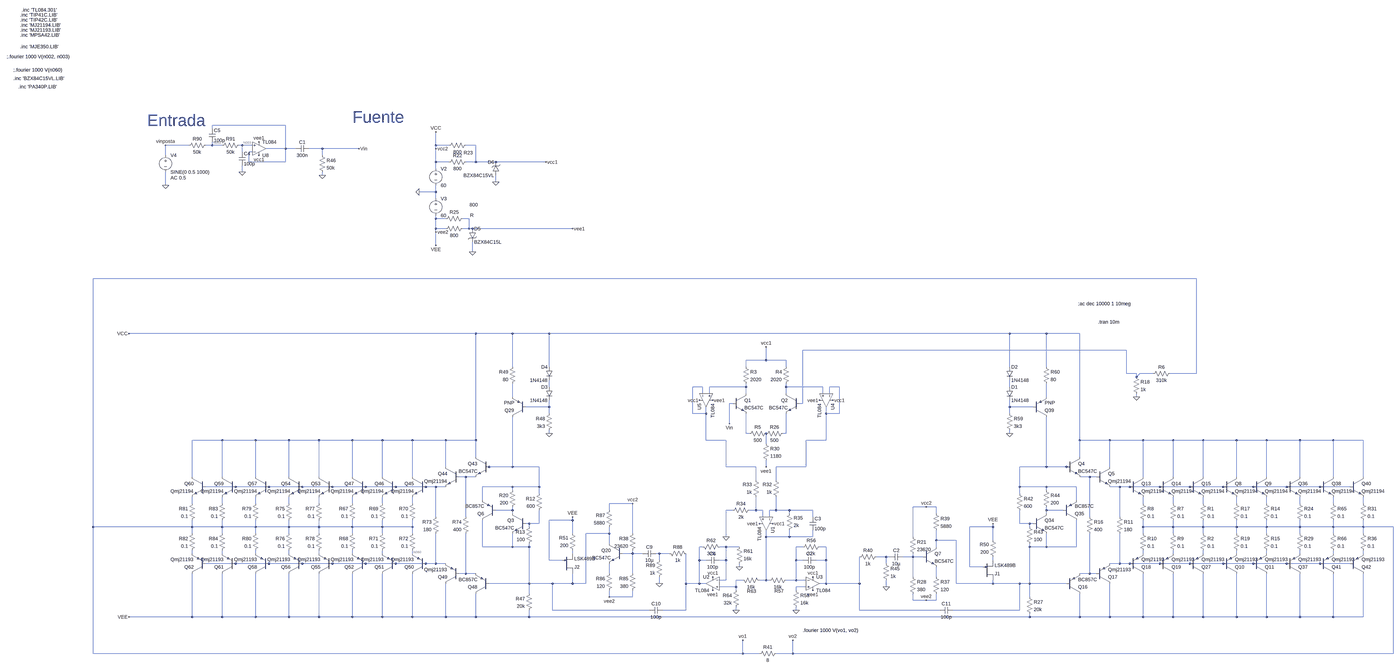
[diagram p0: schematic V7.asc, whole sheet]
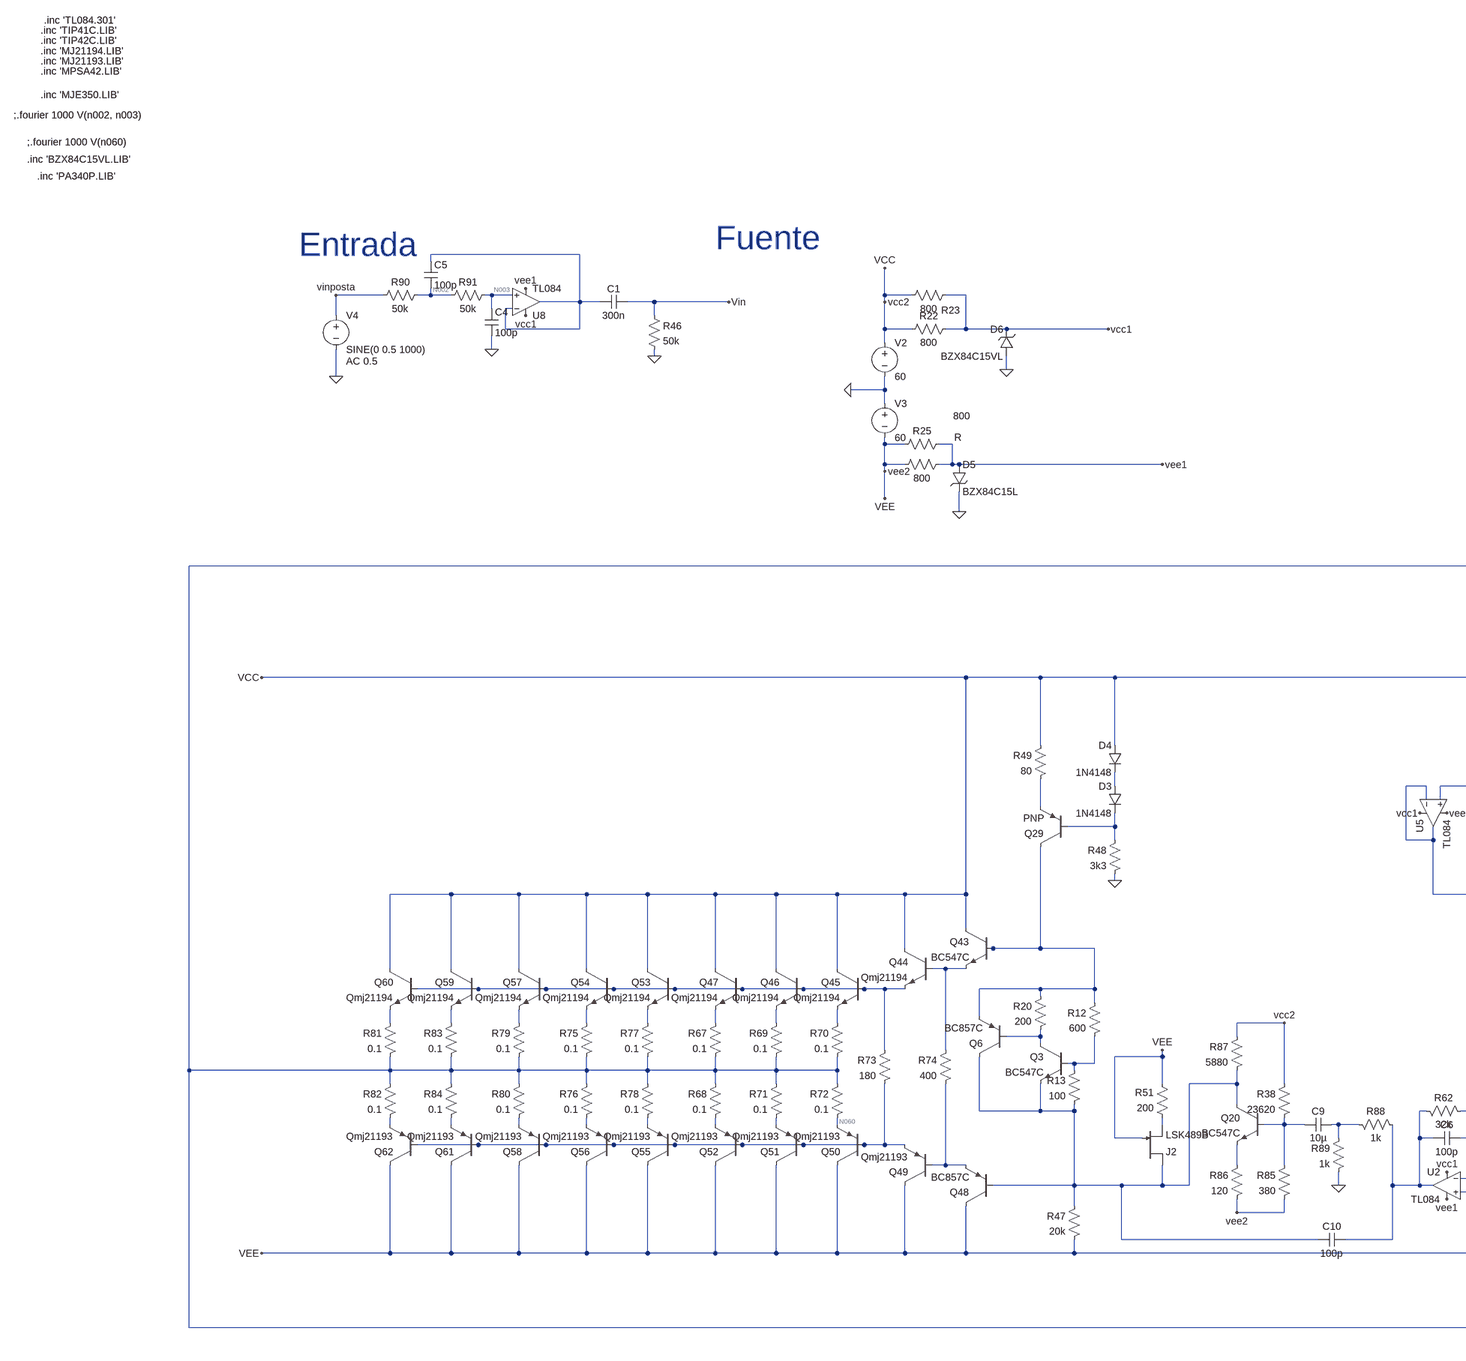
[diagram p1: schematic V7.asc, part, row 1 of 1, column 1 of 2]
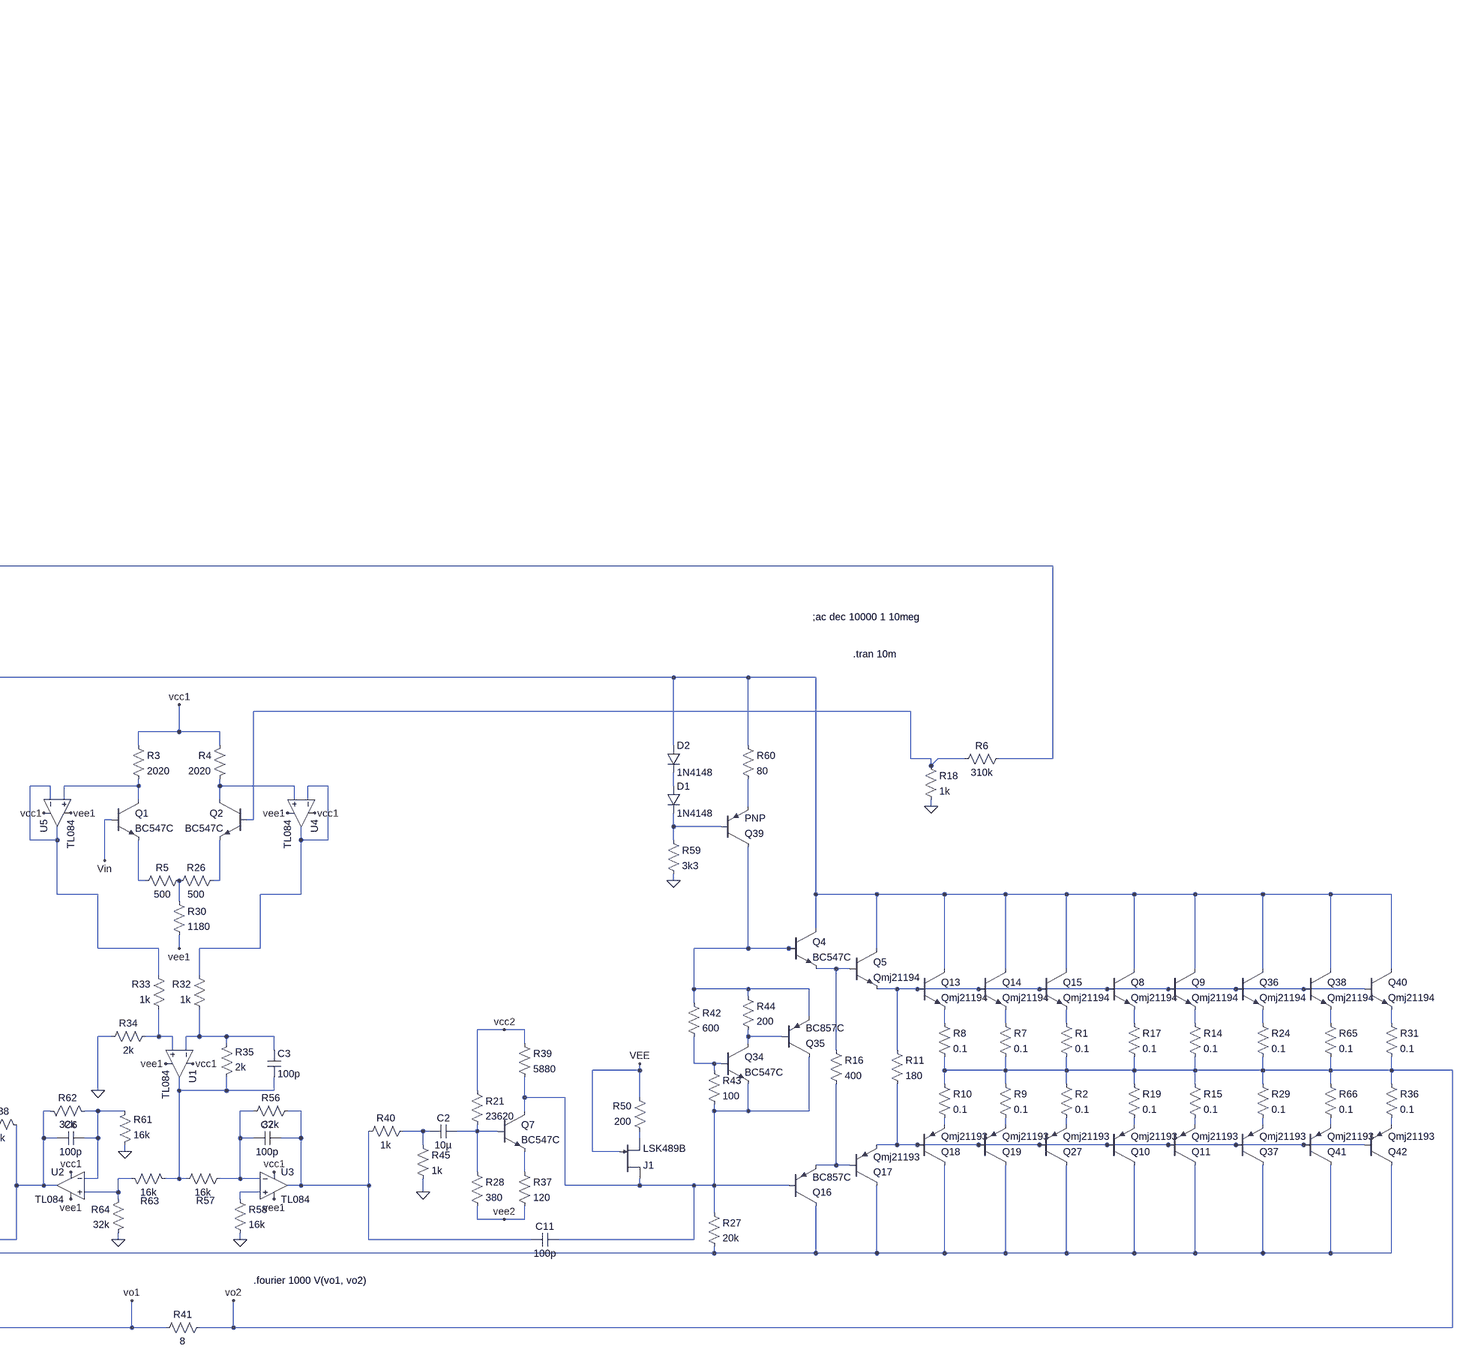
[diagram p2: schematic V7.asc, part, row 1 of 1, column 2 of 2]
V7.asc, the LTspice schematic file:
Version 4
SHEET 1 14776 5396
WIRE 5376 864 5024 864
WIRE 5024 880 5024 864
WIRE 4912 960 4800 960
WIRE 5024 960 5024 944
WIRE 5024 960 4992 960
WIRE 5072 960 5024 960
WIRE 5168 960 5152 960
WIRE 5216 960 5168 960
WIRE 6096 960 6096 896
WIRE 6160 960 6096 960
WIRE 6288 960 6240 960
WIRE 5376 976 5376 864
WIRE 5376 976 5280 976
WIRE 5424 976 5376 976
WIRE 5552 976 5488 976
WIRE 5728 976 5552 976
WIRE 6096 976 6096 960
WIRE 5168 992 5168 960
WIRE 5216 992 5200 992
WIRE 4800 1008 4800 960
WIRE 5552 1008 5552 976
WIRE 5200 1040 5200 992
WIRE 5376 1040 5376 976
WIRE 5376 1040 5200 1040
WIRE 6096 1040 6096 976
WIRE 6160 1040 6096 1040
WIRE 6288 1040 6288 960
WIRE 6288 1040 6240 1040
WIRE 6384 1040 6288 1040
WIRE 6624 1040 6384 1040
WIRE 6096 1072 6096 1040
WIRE 5168 1088 5168 1056
WIRE 5552 1104 5552 1088
WIRE 6384 1136 6384 1104
WIRE 4800 1152 4800 1088
WIRE 6096 1184 6096 1152
WIRE 6096 1184 6016 1184
WIRE 6096 1216 6096 1184
WIRE 6096 1312 6096 1296
WIRE 6144 1312 6096 1312
WIRE 6256 1312 6224 1312
WIRE 6096 1360 6096 1312
WIRE 6144 1360 6096 1360
WIRE 6256 1360 6256 1312
WIRE 6256 1360 6224 1360
WIRE 6272 1360 6256 1360
WIRE 6752 1360 6272 1360
WIRE 6096 1376 6096 1360
WIRE 6096 1440 6096 1376
WIRE 6272 1472 6272 1424
WIRE 9744 1712 4432 1712
WIRE 6288 2000 4624 2000
WIRE 6464 2000 6288 2000
WIRE 6640 2000 6464 2000
WIRE 8848 2000 6640 2000
WIRE 9024 2000 8848 2000
WIRE 9184 2000 9024 2000
WIRE 9408 2080 7856 2080
WIRE 7680 2128 7680 2064
WIRE 7680 2128 7584 2128
WIRE 7776 2128 7680 2128
WIRE 6464 2160 6464 2000
WIRE 6640 2160 6640 2000
WIRE 7584 2160 7584 2128
WIRE 7776 2160 7776 2128
WIRE 8848 2160 8848 2000
WIRE 9024 2160 9024 2000
WIRE 9408 2192 9408 2080
WIRE 9456 2192 9408 2192
WIRE 9536 2192 9472 2192
WIRE 9744 2192 9744 1712
WIRE 9744 2192 9616 2192
WIRE 9456 2208 9456 2192
WIRE 9456 2208 9472 2192
WIRE 6640 2256 6640 2224
WIRE 7376 2256 7328 2256
WIRE 7584 2256 7584 2240
WIRE 7584 2256 7408 2256
WIRE 7776 2256 7776 2240
WIRE 7952 2256 7776 2256
WIRE 8032 2256 7984 2256
WIRE 8848 2256 8848 2224
WIRE 7376 2288 7376 2256
WIRE 7408 2288 7408 2256
WIRE 7584 2288 7584 2256
WIRE 7776 2288 7776 2256
WIRE 7952 2288 7952 2256
WIRE 7984 2288 7984 2256
WIRE 6464 2304 6464 2240
WIRE 9024 2304 9024 2240
WIRE 9456 2304 9456 2288
WIRE 7520 2336 7504 2336
WIRE 7856 2336 7856 2080
WIRE 7856 2336 7840 2336
WIRE 6640 2352 6640 2320
WIRE 6640 2352 6528 2352
WIRE 8848 2352 8848 2320
WIRE 8960 2352 8848 2352
WIRE 6640 2384 6640 2352
WIRE 7328 2384 7328 2256
WIRE 7392 2384 7392 2352
WIRE 7392 2384 7328 2384
WIRE 7968 2384 7968 2352
WIRE 8032 2384 8032 2256
WIRE 8032 2384 7968 2384
WIRE 8848 2384 8848 2352
WIRE 7504 2432 7504 2336
WIRE 6640 2480 6640 2464
WIRE 7584 2480 7584 2384
WIRE 7600 2480 7584 2480
WIRE 7776 2480 7776 2384
WIRE 7776 2480 7760 2480
WIRE 8848 2480 8848 2464
WIRE 5072 2512 4928 2512
WIRE 5232 2512 5072 2512
WIRE 5392 2512 5232 2512
WIRE 5536 2512 5392 2512
WIRE 5696 2512 5536 2512
WIRE 5840 2512 5696 2512
WIRE 5984 2512 5840 2512
WIRE 6144 2512 5984 2512
WIRE 6288 2512 6288 2000
WIRE 6288 2512 6144 2512
WIRE 7392 2512 7392 2384
WIRE 7488 2512 7392 2512
WIRE 7968 2512 7968 2384
WIRE 7968 2512 7872 2512
WIRE 9184 2512 9184 2000
WIRE 9328 2512 9184 2512
WIRE 9488 2512 9328 2512
WIRE 9632 2512 9488 2512
WIRE 9776 2512 9632 2512
WIRE 9936 2512 9776 2512
WIRE 10080 2512 9936 2512
WIRE 10240 2512 10080 2512
WIRE 10400 2512 10240 2512
WIRE 10544 2512 10400 2512
WIRE 7680 2528 7680 2480
WIRE 6288 2592 6288 2512
WIRE 9184 2592 9184 2512
WIRE 6144 2640 6144 2512
WIRE 6352 2640 6336 2640
WIRE 6464 2640 6464 2400
WIRE 6464 2640 6352 2640
WIRE 6592 2640 6464 2640
WIRE 7488 2640 7488 2512
WIRE 7632 2640 7488 2640
WIRE 7680 2640 7680 2608
WIRE 7872 2640 7872 2512
WIRE 7872 2640 7728 2640
WIRE 9024 2640 9024 2400
WIRE 9024 2640 8896 2640
WIRE 9120 2640 9024 2640
WIRE 9136 2640 9120 2640
WIRE 9328 2640 9328 2512
WIRE 4928 2688 4928 2512
WIRE 5072 2688 5072 2512
WIRE 5232 2688 5232 2512
WIRE 5392 2688 5392 2512
WIRE 5536 2688 5536 2512
WIRE 5696 2688 5696 2512
WIRE 5840 2688 5840 2512
WIRE 5984 2688 5984 2512
WIRE 6240 2688 6208 2688
WIRE 6288 2688 6240 2688
WIRE 9232 2688 9184 2688
WIRE 9264 2688 9232 2688
WIRE 9488 2688 9488 2512
WIRE 9632 2688 9632 2512
WIRE 9776 2688 9776 2512
WIRE 9936 2688 9936 2512
WIRE 10080 2688 10080 2512
WIRE 10240 2688 10240 2512
WIRE 10400 2688 10400 2512
WIRE 10544 2688 10544 2512
WIRE 7632 2704 7632 2640
WIRE 7728 2704 7728 2640
WIRE 5136 2736 4992 2736
WIRE 5296 2736 5136 2736
WIRE 5456 2736 5296 2736
WIRE 5600 2736 5456 2736
WIRE 5760 2736 5600 2736
WIRE 5904 2736 5760 2736
WIRE 6048 2736 5904 2736
WIRE 6096 2736 6048 2736
WIRE 6144 2736 6096 2736
WIRE 6464 2736 6320 2736
WIRE 6592 2736 6592 2640
WIRE 6592 2736 6464 2736
WIRE 8896 2736 8896 2640
WIRE 9024 2736 8896 2736
WIRE 9168 2736 9024 2736
WIRE 9376 2736 9328 2736
WIRE 9424 2736 9376 2736
WIRE 9568 2736 9424 2736
WIRE 9712 2736 9568 2736
WIRE 9872 2736 9712 2736
WIRE 10016 2736 9872 2736
WIRE 10176 2736 10016 2736
WIRE 10336 2736 10176 2736
WIRE 10480 2736 10336 2736
WIRE 6464 2752 6464 2736
WIRE 9024 2752 9024 2736
WIRE 6592 2768 6592 2736
WIRE 8896 2768 8896 2736
WIRE 6320 2800 6320 2736
WIRE 9168 2800 9168 2736
WIRE 4928 2816 4928 2784
WIRE 5072 2816 5072 2784
WIRE 5232 2816 5232 2784
WIRE 5392 2816 5392 2784
WIRE 5536 2816 5536 2784
WIRE 5696 2816 5696 2784
WIRE 5840 2816 5840 2784
WIRE 5984 2816 5984 2784
WIRE 7040 2816 6928 2816
WIRE 9488 2816 9488 2784
WIRE 9632 2816 9632 2784
WIRE 9776 2816 9776 2784
WIRE 9936 2816 9936 2784
WIRE 10080 2816 10080 2784
WIRE 10240 2816 10240 2784
WIRE 10400 2816 10400 2784
WIRE 10544 2816 10544 2784
WIRE 8448 2832 8384 2832
WIRE 8496 2832 8448 2832
WIRE 6464 2848 6464 2832
WIRE 6464 2848 6384 2848
WIRE 6928 2848 6928 2816
WIRE 7520 2848 7488 2848
WIRE 7632 2848 7632 2784
WIRE 7632 2848 7600 2848
WIRE 7664 2848 7632 2848
WIRE 7728 2848 7728 2784
WIRE 7728 2848 7696 2848
WIRE 7792 2848 7728 2848
WIRE 7904 2848 7792 2848
WIRE 9024 2848 9024 2832
WIRE 9104 2848 9024 2848
WIRE 6464 2864 6464 2848
WIRE 7792 2864 7792 2848
WIRE 8496 2864 8496 2832
WIRE 9024 2864 9024 2848
WIRE 6096 2880 6096 2736
WIRE 6240 2880 6240 2688
WIRE 7664 2880 7664 2848
WIRE 7696 2880 7696 2848
WIRE 7904 2880 7904 2848
WIRE 9232 2880 9232 2688
WIRE 9376 2880 9376 2736
WIRE 6752 2896 6752 2880
WIRE 6752 2896 6640 2896
WIRE 6544 2912 6528 2912
WIRE 6592 2912 6592 2848
WIRE 6592 2912 6544 2912
WIRE 8896 2912 8896 2848
WIRE 8944 2912 8896 2912
WIRE 8960 2912 8944 2912
WIRE 4432 2928 4432 1712
WIRE 4928 2928 4928 2896
WIRE 4928 2928 4432 2928
WIRE 5072 2928 5072 2896
WIRE 5072 2928 4928 2928
WIRE 5232 2928 5232 2896
WIRE 5232 2928 5072 2928
WIRE 5392 2928 5392 2896
WIRE 5392 2928 5232 2928
WIRE 5536 2928 5536 2896
WIRE 5536 2928 5392 2928
WIRE 5696 2928 5696 2896
WIRE 5696 2928 5536 2928
WIRE 5840 2928 5840 2896
WIRE 5840 2928 5696 2928
WIRE 5984 2928 5984 2896
WIRE 5984 2928 5840 2928
WIRE 6544 2928 6544 2912
WIRE 8768 2928 8768 2912
WIRE 8768 2928 8656 2928
WIRE 8944 2928 8944 2912
WIRE 9488 2928 9488 2896
WIRE 9632 2928 9632 2896
WIRE 9632 2928 9488 2928
WIRE 9776 2928 9776 2896
WIRE 9776 2928 9632 2928
WIRE 9936 2928 9936 2896
WIRE 9936 2928 9776 2928
WIRE 10080 2928 10080 2896
WIRE 10080 2928 9936 2928
WIRE 10240 2928 10240 2896
WIRE 10240 2928 10080 2928
WIRE 10400 2928 10400 2896
WIRE 10400 2928 10240 2928
WIRE 10544 2928 10544 2896
WIRE 10544 2928 10400 2928
WIRE 10688 2928 10544 2928
WIRE 4928 2960 4928 2928
WIRE 5072 2960 5072 2928
WIRE 5232 2960 5232 2928
WIRE 5392 2960 5392 2928
WIRE 5536 2960 5536 2928
WIRE 5696 2960 5696 2928
WIRE 5840 2960 5840 2928
WIRE 5984 2960 5984 2928
WIRE 6752 2960 6752 2896
WIRE 6928 2960 6928 2928
WIRE 6928 2960 6816 2960
WIRE 7040 2960 7040 2816
WIRE 9488 2960 9488 2928
WIRE 9632 2960 9632 2928
WIRE 9776 2960 9776 2928
WIRE 9936 2960 9936 2928
WIRE 10080 2960 10080 2928
WIRE 10240 2960 10240 2928
WIRE 10400 2960 10400 2928
WIRE 10544 2960 10544 2928
WIRE 7488 2976 7488 2848
WIRE 7680 2976 7680 2944
WIRE 7792 2976 7792 2944
WIRE 7792 2976 7680 2976
WIRE 7904 2976 7904 2944
WIRE 7904 2976 7792 2976
WIRE 8384 2976 8384 2832
WIRE 8496 2992 8496 2944
WIRE 8592 2992 8496 2992
WIRE 8768 2992 8768 2928
WIRE 6928 3008 6928 2960
WIRE 6320 3024 6320 2896
WIRE 6464 3024 6464 2960
WIRE 6464 3024 6320 3024
WIRE 6544 3024 6544 3008
WIRE 6544 3024 6464 3024
WIRE 7376 3024 7360 3024
WIRE 7488 3024 7456 3024
WIRE 7552 3024 7488 3024
WIRE 7856 3024 7824 3024
WIRE 7968 3024 7936 3024
WIRE 8496 3024 8496 2992
WIRE 8944 3024 8944 3008
WIRE 9024 3024 9024 2960
WIRE 9024 3024 8944 3024
WIRE 9168 3024 9168 2896
WIRE 9168 3024 9024 3024
WIRE 4928 3056 4928 3040
WIRE 5072 3056 5072 3040
WIRE 5232 3056 5232 3040
WIRE 5392 3056 5392 3040
WIRE 5536 3056 5536 3040
WIRE 5696 3056 5696 3040
WIRE 5840 3056 5840 3040
WIRE 5984 3056 5984 3040
WIRE 6752 3056 6752 3040
WIRE 7040 3056 7040 3040
WIRE 7040 3056 6992 3056
WIRE 7088 3056 7040 3056
WIRE 7168 3056 7152 3056
WIRE 7216 3056 7168 3056
WIRE 9488 3056 9488 3040
WIRE 9632 3056 9632 3040
WIRE 9776 3056 9776 3040
WIRE 9936 3056 9936 3040
WIRE 10080 3056 10080 3040
WIRE 10240 3056 10240 3040
WIRE 10400 3056 10400 3040
WIRE 10544 3056 10544 3040
WIRE 8256 3072 8208 3072
WIRE 8272 3072 8256 3072
WIRE 8384 3072 8384 3056
WIRE 8384 3072 8336 3072
WIRE 8432 3072 8384 3072
WIRE 6640 3088 6640 2896
WIRE 6704 3088 6640 3088
WIRE 7168 3088 7168 3056
WIRE 7360 3088 7360 3024
WIRE 7392 3088 7360 3088
WIRE 7488 3088 7488 3024
WIRE 7488 3088 7456 3088
WIRE 7824 3088 7824 3024
WIRE 7856 3088 7824 3088
WIRE 7968 3088 7968 3024
WIRE 7968 3088 7920 3088
WIRE 8768 3088 8768 3072
WIRE 5136 3104 4992 3104
WIRE 5296 3104 5136 3104
WIRE 5456 3104 5296 3104
WIRE 5600 3104 5456 3104
WIRE 5760 3104 5600 3104
WIRE 5904 3104 5760 3104
WIRE 6048 3104 5904 3104
WIRE 6096 3104 6096 2960
WIRE 6096 3104 6048 3104
WIRE 6144 3104 6096 3104
WIRE 8256 3104 8256 3072
WIRE 9376 3104 9376 2960
WIRE 9376 3104 9328 3104
WIRE 9424 3104 9376 3104
WIRE 9568 3104 9424 3104
WIRE 9712 3104 9568 3104
WIRE 9872 3104 9712 3104
WIRE 10016 3104 9872 3104
WIRE 10176 3104 10016 3104
WIRE 10336 3104 10176 3104
WIRE 10480 3104 10336 3104
WIRE 7552 3120 7552 3104
WIRE 8656 3120 8656 2928
WIRE 8720 3120 8656 3120
WIRE 6240 3152 6240 2960
WIRE 6240 3152 6208 3152
WIRE 6288 3152 6240 3152
WIRE 6928 3152 6928 3104
WIRE 7040 3152 7040 3056
WIRE 9232 3152 9232 2960
WIRE 9232 3152 9184 3152
WIRE 9264 3152 9232 3152
WIRE 8384 3168 8384 3072
WIRE 8496 3168 8496 3120
WIRE 7488 3184 7488 3088
WIRE 7488 3184 7456 3184
WIRE 7568 3184 7536 3184
WIRE 7680 3184 7680 2976
WIRE 7680 3184 7648 3184
WIRE 7696 3184 7680 3184
WIRE 7824 3184 7824 3088
WIRE 7824 3184 7776 3184
WIRE 7872 3184 7824 3184
WIRE 6544 3200 6544 3024
WIRE 6544 3200 6352 3200
WIRE 6656 3200 6544 3200
WIRE 6752 3200 6752 3152
WIRE 6752 3200 6656 3200
WIRE 6816 3200 6816 2960
WIRE 6816 3200 6752 3200
WIRE 7168 3200 7168 3168
WIRE 7296 3200 7296 3056
WIRE 7360 3200 7360 3088
WIRE 7360 3200 7296 3200
WIRE 7392 3200 7360 3200
WIRE 7968 3200 7968 3088
WIRE 7968 3200 7936 3200
WIRE 8128 3200 8128 3072
WIRE 8128 3200 7968 3200
WIRE 8592 3200 8592 2992
WIRE 8768 3200 8768 3184
WIRE 8768 3200 8592 3200
WIRE 8896 3200 8768 3200
WIRE 8944 3200 8944 3024
WIRE 8944 3200 8896 3200
WIRE 9120 3200 8944 3200
WIRE 7536 3216 7536 3184
WIRE 7536 3216 7456 3216
WIRE 7872 3216 7824 3216
WIRE 8256 3216 8256 3184
WIRE 7536 3232 7536 3216
WIRE 7824 3232 7824 3216
WIRE 6544 3248 6544 3200
WIRE 6928 3264 6928 3232
WIRE 7040 3264 7040 3232
WIRE 7040 3264 6928 3264
WIRE 8944 3264 8944 3200
WIRE 8384 3280 8384 3248
WIRE 8448 3280 8384 3280
WIRE 8496 3280 8496 3248
WIRE 8496 3280 8448 3280
WIRE 6656 3328 6656 3200
WIRE 7120 3328 6656 3328
WIRE 7296 3328 7296 3200
WIRE 7296 3328 7184 3328
WIRE 7536 3328 7536 3312
WIRE 7824 3328 7824 3312
WIRE 8128 3328 8128 3200
WIRE 8512 3328 8128 3328
WIRE 8896 3328 8896 3200
WIRE 8896 3328 8576 3328
WIRE 4928 3360 4928 3152
WIRE 4928 3360 4624 3360
WIRE 5072 3360 5072 3152
WIRE 5072 3360 4928 3360
WIRE 5232 3360 5232 3152
WIRE 5232 3360 5072 3360
WIRE 5392 3360 5392 3152
WIRE 5392 3360 5232 3360
WIRE 5536 3360 5536 3152
WIRE 5536 3360 5392 3360
WIRE 5696 3360 5696 3152
WIRE 5696 3360 5536 3360
WIRE 5840 3360 5840 3152
WIRE 5840 3360 5696 3360
WIRE 5984 3360 5984 3152
WIRE 5984 3360 5840 3360
WIRE 6144 3360 6144 3200
WIRE 6144 3360 5984 3360
WIRE 6288 3360 6288 3248
WIRE 6288 3360 6144 3360
WIRE 6544 3360 6544 3328
WIRE 6544 3360 6288 3360
WIRE 8944 3360 8944 3344
WIRE 8944 3360 6544 3360
WIRE 9184 3360 9184 3248
WIRE 9184 3360 8944 3360
WIRE 9328 3360 9328 3200
WIRE 9328 3360 9184 3360
WIRE 9488 3360 9488 3152
WIRE 9488 3360 9328 3360
WIRE 9632 3360 9632 3152
WIRE 9632 3360 9488 3360
WIRE 9776 3360 9776 3152
WIRE 9776 3360 9632 3360
WIRE 9936 3360 9936 3152
WIRE 9936 3360 9776 3360
WIRE 10080 3360 10080 3152
WIRE 10080 3360 9936 3360
WIRE 10240 3360 10240 3152
WIRE 10240 3360 10080 3360
WIRE 10400 3360 10400 3152
WIRE 10400 3360 10240 3360
WIRE 10544 3360 10544 3152
WIRE 10544 3360 10400 3360
WIRE 4432 3536 4432 2928
WIRE 7568 3536 7568 3472
WIRE 7568 3536 4432 3536
WIRE 7648 3536 7568 3536
WIRE 7808 3536 7808 3472
WIRE 7808 3536 7728 3536
WIRE 10688 3536 10688 2928
WIRE 10688 3536 7808 3536
FLAG 6016 1184 0
FLAG 4800 1152 0
FLAG 5728 976 Vin
FLAG 6096 896 VCC
FLAG 6096 1440 VEE
FLAG 7680 2640 vee1
FLAG 7648 2912 vee1
FLAG 7680 2064 vcc1
FLAG 7712 2912 vcc1
FLAG 6096 976 vcc2
FLAG 6096 1376 vee2
FLAG 8848 2480 0
FLAG 6640 2480 0
FLAG 4624 3360 VEE
FLAG 4624 2000 VCC
FLAG 7488 2976 0
FLAG 7824 3328 0
FLAG 7552 3120 0
FLAG 7536 3328 0
FLAG 6384 1136 0
FLAG 6272 1472 0
FLAG 7568 3472 vo1
FLAG 7808 3472 vo2
FLAG 8000 2320 vcc1
FLAG 7936 2320 vee1
FLAG 7360 2320 vcc1
FLAG 7424 2320 vee1
FLAG 7904 3232 vee1
FLAG 7424 3232 vee1
FLAG 7424 3168 vcc1
FLAG 7904 3168 vcc1
FLAG 6624 1040 vcc1
FLAG 6752 1360 vee1
FLAG 7504 2432 Vin
FLAG 8448 2832 vcc2
FLAG 8448 3280 vee2
FLAG 8256 3216 0
FLAG 7040 2816 vcc2
FLAG 6928 3264 vee2
FLAG 7168 3200 0
FLAG 9456 2304 0
FLAG 5168 1088 0
FLAG 5248 1008 vcc1
FLAG 5248 944 vee1
FLAG 4800 960 vinposta
FLAG 5552 1104 0
FLAG 8768 2912 VEE
FLAG 6752 2880 VEE
SYMBOL npn 9120 2592 R0
SYMATTR InstName Q4
SYMATTR Value BC547C
SYMBOL npn 9264 2640 R0
SYMATTR InstName Q5
SYMATTR Value Qmj21194
SYMBOL npn 9424 2688 R0
SYMATTR InstName Q13
SYMATTR Value Qmj21194
SYMBOL npn 9568 2688 R0
SYMATTR InstName Q14
SYMATTR Value Qmj21194
SYMBOL npn 9712 2688 R0
SYMATTR InstName Q15
SYMATTR Value Qmj21194
SYMBOL pnp 9120 3248 M180
SYMATTR InstName Q16
SYMATTR Value BC857C
SYMBOL pnp 9264 3200 M180
SYMATTR InstName Q17
SYMATTR Value Qmj21193
SYMBOL pnp 9424 3152 M180
SYMATTR InstName Q18
SYMATTR Value Qmj21193
SYMBOL pnp 9568 3152 M180
SYMATTR InstName Q19
SYMATTR Value Qmj21193
SYMBOL pnp 9712 3152 M180
SYMATTR InstName Q27
SYMATTR Value Qmj21193
SYMBOL res 9760 2800 R0
SYMATTR InstName R1
SYMATTR Value 0.1
SYMBOL res 9760 2944 R0
SYMATTR InstName R2
SYMATTR Value 0.1
SYMBOL res 9616 2800 R0
SYMATTR InstName R7
SYMATTR Value 0.1
SYMBOL res 9472 2800 R0
SYMATTR InstName R8
SYMATTR Value 0.1
SYMBOL res 9616 2944 R0
SYMATTR InstName R9
SYMATTR Value 0.1
SYMBOL res 9472 2944 R0
SYMATTR InstName R10
SYMATTR Value 0.1
SYMBOL res 9360 2864 R0
SYMATTR InstName R11
SYMATTR Value 180
SYMBOL res 9216 2864 R0
SYMATTR InstName R16
SYMATTR Value 400
SYMBOL npn 8960 2864 R0
SYMATTR InstName Q34
SYMATTR Value BC547C
SYMBOL res 8880 2752 R0
SYMATTR InstName R42
SYMATTR Value 600
SYMBOL res 8928 2912 R0
SYMATTR InstName R43
SYMATTR Value 100
SYMBOL res 9008 2736 R0
SYMATTR InstName R44
SYMATTR Value 200
SYMBOL pnp 9104 2896 M180
SYMATTR InstName Q35
SYMATTR Value BC857C
SYMBOL voltage 6096 1056 R0
WINDOW 123 0 0 Left 0
WINDOW 39 24 44 Left 2
SYMATTR InstName V2
SYMATTR Value 60
SYMBOL voltage 6096 1200 R0
WINDOW 123 0 0 Left 0
WINDOW 39 24 124 Left 2
SYMATTR InstName V3
SYMATTR Value 60
SYMBOL voltage 4800 992 R0
WINDOW 123 24 124 Left 2
WINDOW 39 0 0 Left 0
SYMATTR Value2 AC 0.5
SYMATTR InstName V4
SYMATTR Value SINE(0 0.5 1000)
SYMBOL npn 7520 2288 R0
SYMATTR InstName Q1
SYMATTR Value BC547C
SYMBOL npn 7840 2288 M0
SYMATTR InstName Q2
SYMATTR Value BC547C
SYMBOL res 7568 2144 R0
SYMATTR InstName R3
SYMATTR Value 2020
SYMBOL res 7792 2144 M0
SYMATTR InstName R4
SYMATTR Value 2020
SYMBOL res 7696 2464 R90
WINDOW 0 0 56 VBottom 2
WINDOW 3 32 56 VTop 2
SYMATTR InstName R5
SYMATTR Value 500
SYMBOL res 7776 2464 R90
WINDOW 0 0 56 VBottom 2
WINDOW 3 32 56 VTop 2
SYMATTR InstName R26
SYMATTR Value 500
SYMBOL res 7664 2512 R0
SYMATTR InstName R30
SYMATTR Value 1180
SYMBOL Opamps\\opamp2 7744 2912 R90
SYMATTR InstName U1
SYMATTR Value TL084
SYMBOL res 7744 2800 R180
WINDOW 0 36 76 Left 2
WINDOW 3 36 40 Left 2
SYMATTR InstName R32
SYMATTR Value 1k
SYMBOL res 7648 2800 R180
WINDOW 0 36 76 Left 2
WINDOW 3 36 40 Left 2
SYMATTR InstName R33
SYMATTR Value 1k
SYMBOL res 7616 2832 R90
WINDOW 0 0 56 VBottom 2
WINDOW 3 32 56 VTop 2
SYMATTR InstName R34
SYMATTR Value 2k
SYMBOL res 7776 2960 M180
WINDOW 0 36 76 Left 2
WINDOW 3 36 40 Left 2
SYMATTR InstName R35
SYMATTR Value 2k
SYMBOL res 8928 3248 R0
SYMATTR InstName R27
SYMATTR Value 20k
SYMBOL pnp 8960 2400 M180
SYMATTR InstName Q39
SYMBOL res 8832 2368 R0
SYMATTR InstName R59
SYMATTR Value 3k3
SYMBOL diode 8832 2256 R0
SYMATTR InstName D1
SYMATTR Value 1N4148
SYMBOL diode 8832 2160 R0
SYMATTR InstName D2
SYMATTR Value 1N4148
SYMBOL res 9008 2144 R0
SYMATTR InstName R60
SYMATTR Value 80
SYMBOL npn 9872 2688 R0
SYMATTR InstName Q8
SYMATTR Value Qmj21194
SYMBOL npn 10016 2688 R0
SYMATTR InstName Q9
SYMATTR Value Qmj21194
SYMBOL pnp 9872 3152 M180
SYMATTR InstName Q10
SYMATTR Value Qmj21193
SYMBOL pnp 10016 3152 M180
SYMATTR InstName Q11
SYMATTR Value Qmj21193
SYMBOL res 10064 2800 R0
SYMATTR InstName R14
SYMATTR Value 0.1
SYMBOL res 10064 2944 R0
SYMATTR InstName R15
SYMATTR Value 0.1
SYMBOL res 9920 2800 R0
SYMATTR InstName R17
SYMATTR Value 0.1
SYMBOL res 9920 2944 R0
SYMATTR InstName R19
SYMATTR Value 0.1
SYMBOL res 6560 3232 M0
SYMATTR InstName R47
SYMATTR Value 20k
SYMBOL pnp 6528 2400 R180
SYMATTR InstName Q29
SYMBOL res 6656 2368 M0
SYMATTR InstName R48
SYMATTR Value 3k3
SYMBOL diode 6656 2256 M0
SYMATTR InstName D3
SYMATTR Value 1N4148
SYMBOL diode 6656 2160 M0
SYMATTR InstName D4
SYMATTR Value 1N4148
SYMBOL res 6480 2144 M0
SYMATTR InstName R49
SYMATTR Value 80
SYMBOL res 7744 3520 R90
WINDOW 0 0 56 VBottom 2
WINDOW 3 32 56 VTop 2
SYMATTR InstName R41
SYMATTR Value 8
SYMBOL res 7952 3008 R90
WINDOW 0 0 56 VBottom 2
WINDOW 3 32 56 VTop 2
SYMATTR InstName R56
SYMATTR Value 32k
SYMBOL res 7792 3168 R90
WINDOW 0 83 50 VBottom 2
WINDOW 3 32 56 VTop 2
SYMATTR InstName R57
SYMATTR Value 16k
SYMBOL res 7808 3216 R0
SYMATTR InstName R58
SYMATTR Value 16k
SYMBOL res 7536 3120 M180
WINDOW 0 36 76 Left 2
WINDOW 3 36 40 Left 2
SYMATTR InstName R61
SYMATTR Value 16k
SYMBOL res 7360 3008 M90
WINDOW 0 0 56 VBottom 2
WINDOW 3 32 56 VTop 2
SYMATTR InstName R62
SYMATTR Value 32k
SYMBOL res 7664 3200 M270
WINDOW 0 -52 54 VTop 2
WINDOW 3 0 56 VBottom 2
SYMATTR InstName R63
SYMATTR Value 16k
SYMBOL res 7552 3216 M0
SYMATTR InstName R64
SYMATTR Value 32k
SYMBOL res 6256 1024 R90
WINDOW 0 0 56 VBottom 2
WINDOW 3 32 56 VTop 2
SYMATTR InstName R22
SYMATTR Value 800
SYMBOL res 6240 1344 R90
WINDOW 0 -33 -29 VBottom 2
WINDOW 3 32 56 VTop 2
SYMATTR InstName R
SYMATTR Value 800
SYMBOL zener 6256 1360 R0
SYMATTR InstName D5
SYMATTR Value BZX84C15L
SYMBOL zener 6400 1104 R180
WINDOW 0 24 64 Left 2
WINDOW 3 24 0 Left 2
SYMATTR InstName D6
SYMATTR Value BZX84C15VL
SYMBOL res 6256 944 R90
WINDOW 0 67 4 VBottom 2
WINDOW 3 32 56 VTop 2
SYMATTR InstName R23
SYMATTR Value 800
SYMBOL res 6240 1296 R90
WINDOW 0 0 56 VBottom 2
WINDOW 3 -67 -38 VTop 2
SYMATTR InstName R25
SYMATTR Value 800
SYMBOL npn 10176 2688 R0
SYMATTR InstName Q36
SYMATTR Value Qmj21194
SYMBOL pnp 10176 3152 M180
SYMATTR InstName Q37
SYMATTR Value Qmj21193
SYMBOL res 10224 2800 R0
SYMATTR InstName R24
SYMATTR Value 0.1
SYMBOL res 10224 2944 R0
SYMATTR InstName R29
SYMATTR Value 0.1
SYMBOL npn 10336 2688 R0
SYMATTR InstName Q38
SYMATTR Value Qmj21194
SYMBOL npn 10480 2688 R0
SYMATTR InstName Q40
SYMATTR Value Qmj21194
SYMBOL pnp 10336 3152 M180
SYMATTR InstName Q41
SYMATTR Value Qmj21193
SYMBOL pnp 10480 3152 M180
SYMATTR InstName Q42
SYMATTR Value Qmj21193
SYMBOL res 10528 2800 R0
SYMATTR InstName R31
SYMATTR Value 0.1
SYMBOL res 10528 2944 R0
SYMATTR InstName R36
SYMATTR Value 0.1
SYMBOL res 10384 2800 R0
SYMATTR InstName R65
SYMATTR Value 0.1
SYMBOL res 10384 2944 R0
SYMATTR InstName R66
SYMATTR Value 0.1
SYMBOL npn 6352 2592 M0
SYMATTR InstName Q43
SYMATTR Value BC547C
SYMBOL npn 6208 2640 M0
SYMATTR InstName Q44
SYMATTR Value Qmj21194
SYMBOL npn 6048 2688 M0
SYMATTR InstName Q45
SYMATTR Value Qmj21194
SYMBOL npn 5904 2688 M0
SYMATTR InstName Q46
SYMATTR Value Qmj21194
SYMBOL npn 5760 2688 M0
SYMATTR InstName Q47
SYMATTR Value Qmj21194
SYMBOL pnp 6352 3248 R180
SYMATTR InstName Q48
SYMATTR Value BC857C
SYMBOL pnp 6208 3200 R180
SYMATTR InstName Q49
SYMATTR Value Qmj21193
SYMBOL pnp 6048 3152 R180
SYMATTR InstName Q50
SYMATTR Value Qmj21193
SYMBOL pnp 5904 3152 R180
SYMATTR InstName Q51
SYMATTR Value Qmj21193
SYMBOL pnp 5760 3152 R180
SYMATTR InstName Q52
SYMATTR Value Qmj21193
SYMBOL res 5712 2800 M0
SYMATTR InstName R67
SYMATTR Value 0.1
SYMBOL res 5712 2944 M0
SYMATTR InstName R68
SYMATTR Value 0.1
SYMBOL res 5856 2800 M0
SYMATTR InstName R69
SYMATTR Value 0.1
SYMBOL res 6000 2800 M0
SYMATTR InstName R70
SYMATTR Value 0.1
SYMBOL res 5856 2944 M0
SYMATTR InstName R71
SYMATTR Value 0.1
SYMBOL res 6000 2944 M0
SYMATTR InstName R72
SYMATTR Value 0.1
SYMBOL res 6112 2864 M0
SYMATTR InstName R73
SYMATTR Value 180
SYMBOL res 6256 2864 M0
SYMATTR InstName R74
SYMATTR Value 400
SYMBOL npn 5600 2688 M0
SYMATTR InstName Q53
SYMATTR Value Qmj21194
SYMBOL npn 5456 2688 M0
SYMATTR InstName Q54
SYMATTR Value Qmj21194
SYMBOL pnp 5600 3152 R180
SYMATTR InstName Q55
SYMATTR Value Qmj21193
SYMBOL pnp 5456 3152 R180
SYMATTR InstName Q56
SYMATTR Value Qmj21193
SYMBOL res 5408 2800 M0
SYMATTR InstName R75
SYMATTR Value 0.1
SYMBOL res 5408 2944 M0
SYMATTR InstName R76
SYMATTR Value 0.1
SYMBOL res 5552 2800 M0
SYMATTR InstName R77
SYMATTR Value 0.1
SYMBOL res 5552 2944 M0
SYMATTR InstName R78
SYMATTR Value 0.1
SYMBOL npn 5296 2688 M0
SYMATTR InstName Q57
SYMATTR Value Qmj21194
SYMBOL pnp 5296 3152 R180
SYMATTR InstName Q58
SYMATTR Value Qmj21193
SYMBOL res 5248 2800 M0
SYMATTR InstName R79
SYMATTR Value 0.1
SYMBOL res 5248 2944 M0
SYMATTR InstName R80
SYMATTR Value 0.1
SYMBOL npn 5136 2688 M0
SYMATTR InstName Q59
SYMATTR Value Qmj21194
SYMBOL npn 4992 2688 M0
SYMATTR InstName Q60
SYMATTR Value Qmj21194
SYMBOL pnp 5136 3152 R180
SYMATTR InstName Q61
SYMATTR Value Qmj21193
SYMBOL pnp 4992 3152 R180
SYMATTR InstName Q62
SYMATTR Value Qmj21193
SYMBOL res 4944 2800 M0
SYMATTR InstName R81
SYMATTR Value 0.1
SYMBOL res 4944 2944 M0
SYMATTR InstName R82
SYMATTR Value 0.1
SYMBOL res 5088 2800 M0
SYMATTR InstName R83
SYMATTR Value 0.1
SYMBOL res 5088 2944 M0
SYMATTR InstName R84
SYMATTR Value 0.1
SYMBOL Opamps\\opamp2 7424 3136 M0
SYMATTR InstName U2
SYMATTR Value TL084
SYMBOL Opamps\\opamp2 7904 3136 R0
SYMATTR InstName U3
SYMATTR Value TL084
SYMBOL Opamps\\opamp2 8032 2320 R90
SYMATTR InstName U4
SYMATTR Value TL084
SYMBOL Opamps\\opamp2 7328 2320 M90
SYMATTR InstName U5
SYMATTR Value TL084
SYMBOL npn 6528 2864 M0
SYMATTR InstName Q3
SYMATTR Value BC547C
SYMBOL res 6608 2752 M0
SYMATTR InstName R12
SYMATTR Value 600
SYMBOL res 6560 2912 M0
SYMATTR InstName R13
SYMATTR Value 100
SYMBOL res 6480 2736 M0
SYMATTR InstName R20
SYMATTR Value 200
SYMBOL pnp 6384 2896 R180
SYMATTR InstName Q6
SYMATTR Value BC857C
SYMBOL cap 8336 3056 R90
WINDOW 0 0 32 VBottom 2
WINDOW 3 32 32 VTop 2
SYMATTR InstName C2
SYMATTR Value 10µ
SYMATTR SpiceLine Rser=0.1
SYMBOL res 8368 2960 R0
SYMATTR InstName R21
SYMATTR Value 23620
SYMBOL res 8368 3152 R0
SYMATTR InstName R28
SYMATTR Value 380
SYMBOL npn 8432 3024 R0
SYMATTR InstName Q7
SYMATTR Value BC547C
SYMBOL res 8480 3152 R0
SYMATTR InstName R37
SYMATTR Value 120
SYMBOL res 8480 2848 R0
SYMATTR InstName R39
SYMATTR Value 5880
SYMBOL res 8224 3056 R90
WINDOW 0 0 56 VBottom 2
WINDOW 3 32 56 VTop 2
SYMATTR InstName R40
SYMATTR Value 1k
SYMBOL res 8240 3088 R0
SYMATTR InstName R45
SYMATTR Value 1k
SYMBOL cap 7088 3040 M90
WINDOW 0 0 32 VBottom 2
WINDOW 3 32 32 VTop 2
SYMATTR InstName C9
SYMATTR Value 10µ
SYMATTR SpiceLine Rser=0.1
SYMBOL res 7056 2944 M0
SYMATTR InstName R38
SYMATTR Value 23620
SYMBOL res 7056 3136 M0
SYMATTR InstName R85
SYMATTR Value 380
SYMBOL npn 6992 3008 M0
SYMATTR InstName Q20
SYMATTR Value BC547C
SYMBOL res 6944 3136 M0
SYMATTR InstName R86
SYMATTR Value 120
SYMBOL res 6944 2832 M0
SYMATTR InstName R87
SYMATTR Value 5880
SYMBOL res 7200 3040 M90
WINDOW 0 0 56 VBottom 2
WINDOW 3 32 56 VTop 2
SYMATTR InstName R88
SYMATTR Value 1k
SYMBOL res 7184 3072 M0
SYMATTR InstName R89
SYMATTR Value 1k
SYMBOL res 9632 2176 R90
WINDOW 0 0 56 VBottom 2
WINDOW 3 32 56 VTop 2
SYMATTR InstName R6
SYMATTR Value 310k
SYMBOL res 9440 2192 R0
SYMATTR InstName R18
SYMATTR Value 1k
SYMBOL Opamps\\opamp2 5248 1040 M180
SYMATTR InstName U8
SYMATTR Value TL084
SYMBOL res 5008 944 R90
WINDOW 0 0 56 VBottom 2
WINDOW 3 32 56 VTop 2
SYMATTR InstName R90
SYMATTR Value 50k
SYMBOL res 5168 944 R90
WINDOW 0 0 56 VBottom 2
WINDOW 3 32 56 VTop 2
SYMATTR InstName R91
SYMATTR Value 50k
SYMBOL cap 5152 992 R0
SYMATTR InstName C4
SYMATTR Value 100p
SYMATTR SpiceLine Rser=0.1
SYMBOL cap 5008 880 R0
SYMATTR InstName C5
SYMATTR Value 100p
SYMATTR SpiceLine Rser=0.1
SYMBOL cap 5488 960 R90
WINDOW 0 0 32 VBottom 2
WINDOW 3 32 32 VTop 2
SYMATTR InstName C1
SYMATTR Value 300n
SYMATTR SpiceLine Rser=0.1
SYMBOL res 5536 992 R0
SYMATTR InstName R46
SYMATTR Value 50k
SYMBOL cap 7888 2880 R0
SYMATTR InstName C3
SYMATTR Value 100p
SYMATTR SpiceLine Rser=0.1
SYMBOL cap 7456 3072 R90
WINDOW 0 0 32 VBottom 2
WINDOW 3 32 32 VTop 2
SYMATTR InstName C6
SYMATTR Value 100p
SYMATTR SpiceLine Rser=0.1
SYMBOL cap 7920 3072 R90
WINDOW 0 0 32 VBottom 2
WINDOW 3 32 32 VTop 2
SYMATTR InstName C7
SYMATTR Value 100p
SYMATTR SpiceLine Rser=0.1
SYMBOL cap 7184 3312 R90
WINDOW 0 0 32 VBottom 2
WINDOW 3 32 32 VTop 2
SYMATTR InstName C10
SYMATTR Value 100p
SYMBOL cap 8576 3312 R90
WINDOW 0 0 32 VBottom 2
WINDOW 3 32 32 VTop 2
SYMATTR InstName C11
SYMATTR Value 100p
SYMBOL njf 8720 3184 M180
SYMATTR InstName J1
SYMATTR Value LSK489B
SYMBOL res 8784 3088 R180
WINDOW 0 36 76 Left 2
WINDOW 3 36 40 Left 2
SYMATTR InstName R50
SYMATTR Value 200
SYMBOL njf 6704 3152 M180
SYMATTR InstName J2
SYMATTR Value LSK489B
SYMBOL res 6768 3056 R180
WINDOW 0 36 76 Left 2
WINDOW 3 36 40 Left 2
SYMATTR InstName R51
SYMATTR Value 200
TEXT -568 -744 Left 2 !.inc 'TL084.301'
TEXT -576 -720 Left 2 !.inc 'TIP41C.LIB'
TEXT -640 -520 Left 2 !;.fourier 1000 V(n002, n003)
TEXT -576 -696 Left 2 !.inc 'TIP42C.LIB'
TEXT -576 -672 Left 2 !.inc 'MJ21194.LIB'
TEXT -576 -648 Left 2 !.inc 'MJ21193.LIB'
TEXT -576 -624 Left 2 !.inc 'MPSA42.LIB'
TEXT -576 -568 Left 2 !.inc 'MJE350.LIB'
TEXT -608 -456 Left 2 !;.fourier 1000 V(n060)
TEXT 5696 824 Left 6 ;Fuente
TEXT 4712 840 Left 6 ;Entrada
TEXT 9176 1856 Left 2 !;ac dec 10000 1 10meg
TEXT 7856 3424 Left 2 !.fourier 1000 V(vo1, vo2)
TEXT -608 -416 Left 2 !.inc 'BZX84C15VL.LIB'
TEXT -584 -376 Left 2 !.inc 'PA340P.LIB'
TEXT 9272 1944 Left 2 !.tran 10m

The netlist it stands for:
* V7.asc
Q4 vcc2 N019 N021 0 BC547C
Q5 vcc2 N021 N023 0 Qmj21194
Q13 vcc2 N023 N032 0 Qmj21194
Q14 vcc2 N023 N033 0 Qmj21194
Q15 vcc2 N023 N034 0 Qmj21194
Q16 vee2 N048 N079 0 BC857C
Q17 vee2 N079 N076 0 Qmj21193
Q18 vee2 N076 N064 0 Qmj21193
Q19 vee2 N076 N065 0 Qmj21193
Q27 vee2 N076 N066 0 Qmj21193
R1 N034 vo2 0.1
R2 vo2 N066 0.1
R7 N033 vo2 0.1
R8 N032 vo2 0.1
R9 vo2 N065 0.1
R10 vo2 N064 0.1
R11 N023 N076 180
R16 N021 N079 400
Q34 N043 N045 N048 0 BC547C
R42 N019 N045 600
R43 N045 N048 100
R44 N019 N043 200
Q35 N048 N043 N019 0 BC857C
V2 vcc2 0 60
V3 0 vee2 60
V4 vinposta 0 SINE(0 0.5 1000) AC 0.5
Q1 N007 Vin N015 0 BC547C
Q2 N008 N004 N016 0 BC547C
R3 vcc1 N007 2020
R4 vcc1 N008 2020
R5 N017 N015 500
R26 N016 N017 500
R30 N017 vee1 1180
XU1 N041 N042 vcc1 vee1 N047 TL084  ; pins In+ In- V+ V- OUT
R32 N042 N009 1k
R33 N041 N006 1k
R34 N041 0 2k
R35 N047 N042 2k
R27 N048 vee2 20k
Q39 N019 N014 N012 0 PNP
R59 N014 0 3k3
D1 N010 N014 1N4148
D2 vcc2 N010 1N4148
R60 vcc2 N012 80
Q8 vcc2 N023 N035 0 Qmj21194
Q9 vcc2 N023 N036 0 Qmj21194
Q10 vee2 N076 N067 0 Qmj21193
Q11 vee2 N076 N068 0 Qmj21193
R14 N036 vo2 0.1
R15 vo2 N068 0.1
R17 N035 vo2 0.1
R19 vo2 N067 0.1
R47 N046 vee2 20k
Q29 N018 N013 N011 0 PNP
R48 N013 0 3k3
D3 N005 N013 1N4148
D4 vcc2 N005 1N4148
R49 vcc2 N011 80
R41 vo2 vo1 8
R56 N052 N051 32k
R57 N051 N047 16k
R58 N082 0 16k
R61 0 N050 16k
R62 N049 N050 32k
R63 N047 N081 16k
R64 N081 0 32k
R22 vcc1 vcc2 800
R vee1 vee2 800
D5 vee1 0 BZX84C15L
D6 0 vcc1 BZX84C15VL
R23 vcc1 vcc2 800
R25 vee1 vee2 800
Q36 vcc2 N023 N037 0 Qmj21194
Q37 vee2 N076 N069 0 Qmj21193
R24 N037 vo2 0.1
R29 vo2 N069 0.1
Q38 vcc2 N023 N038 0 Qmj21194
Q40 vcc2 N023 N039 0 Qmj21194
Q41 vee2 N076 N070 0 Qmj21193
Q42 vee2 N076 N071 0 Qmj21193
R31 N039 vo2 0.1
R36 vo2 N071 0.1
R65 N038 vo2 0.1
R66 vo2 N070 0.1
Q43 vcc2 N018 N020 0 BC547C
Q44 vcc2 N020 N022 0 Qmj21194
Q45 vcc2 N022 N031 0 Qmj21194
Q46 vcc2 N022 N030 0 Qmj21194
Q47 vcc2 N022 N029 0 Qmj21194
Q48 vee2 N046 N077 0 BC857C
Q49 vee2 N077 N075 0 Qmj21193
Q50 vee2 N075 N060 0 Qmj21193
Q51 vee2 N075 N059 0 Qmj21193
Q52 vee2 N075 N058 0 Qmj21193
R67 N029 vo1 0.1
R68 vo1 N058 0.1
R69 N030 vo1 0.1
R70 N031 vo1 0.1
R71 vo1 N059 0.1
R72 vo1 N060 0.1
R73 N022 N075 180
R74 N020 N077 400
Q53 vcc2 N022 N028 0 Qmj21194
Q54 vcc2 N022 N027 0 Qmj21194
Q55 vee2 N075 N057 0 Qmj21193
Q56 vee2 N075 N056 0 Qmj21193
R75 N027 vo1 0.1
R76 vo1 N056 0.1
R77 N028 vo1 0.1
R78 vo1 N057 0.1
Q57 vcc2 N022 N026 0 Qmj21194
Q58 vee2 N075 N055 0 Qmj21193
R79 N026 vo1 0.1
R80 vo1 N055 0.1
Q59 vcc2 N022 N025 0 Qmj21194
Q60 vcc2 N022 N024 0 Qmj21194
Q61 vee2 N075 N054 0 Qmj21193
Q62 vee2 N075 N053 0 Qmj21193
R81 N024 vo1 0.1
R82 vo1 N053 0.1
R83 N025 vo1 0.1
R84 vo1 N054 0.1
XU2 N081 N050 vcc1 vee1 N049 TL084  ; pins In+ In- V+ V- OUT
XU3 N082 N051 vcc1 vee1 N052 TL084  ; pins In+ In- V+ V- OUT
XU4 N008 N009 vcc1 vee1 N009 TL084  ; pins In+ In- V+ V- OUT
XU5 N007 N006 vcc1 vee1 N006 TL084  ; pins In+ In- V+ V- OUT
Q3 N040 N044 N046 0 BC547C
R12 N018 N044 600
R13 N044 N046 100
R20 N018 N040 200
Q6 N046 N040 N018 0 BC857C
C2 N073 N072 10µ Rser=0.1
R21 vcc2 N073 23620
R28 N073 vee2 380
Q7 N048 N073 N080 0 BC547C
R37 N080 vee2 120
R39 vcc2 N048 5880
R40 N072 N052 1k
R45 N072 0 1k
C9 N062 N063 10µ Rser=0.1
R38 vcc2 N062 23620
R85 N062 vee2 380
Q20 N046 N062 N078 0 BC547C
R86 N078 vee2 120
R87 vcc2 N046 5880
R88 N063 N049 1k
R89 N063 0 1k
R6 vo1 N004 310k
R18 N004 0 1k
XU8 N003 N001 vcc1 vee1 N001 TL084  ; pins In+ In- V+ V- OUT
R90 N002 vinposta 50k
R91 N003 N002 50k
C4 N003 0 100p Rser=0.1
C5 N001 N002 100p Rser=0.1
C1 Vin N001 300n Rser=0.1
R46 Vin 0 50k
C3 N042 N047 100p Rser=0.1
C6 N050 N049 100p Rser=0.1
C7 N052 N051 100p Rser=0.1
C10 N049 N046 100p
C11 N048 N052 100p
J1 N048 vee2 N074 LSK489B
R50 N074 vee2 200
J2 N046 vee2 N061 LSK489B
R51 N061 vee2 200
.model D D
.lib standard.dio
.model NPN NPN
.model PNP PNP
.lib standard.bjt
.model NJF NJF
.model PJF PJF
.lib standard.jft
.inc 'TL084.301'
.inc 'TIP41C.LIB'
;.fourier 1000 V(n002, n003)
.inc 'TIP42C.LIB'
.inc 'MJ21194.LIB'
.inc 'MJ21193.LIB'
.inc 'MPSA42.LIB'
.inc 'MJE350.LIB'
;.fourier 1000 V(n060)
* Fuente
* Entrada
;ac dec 10000 1 10meg
.fourier 1000 V(vo1, vo2)
.inc 'BZX84C15VL.LIB'
.inc 'PA340P.LIB'
.tran 10m
.backanno
.end